# Altium schematic sheet TB_Driver.SchDoc
size A3; SheetNumber: 2; SheetTotal: 3
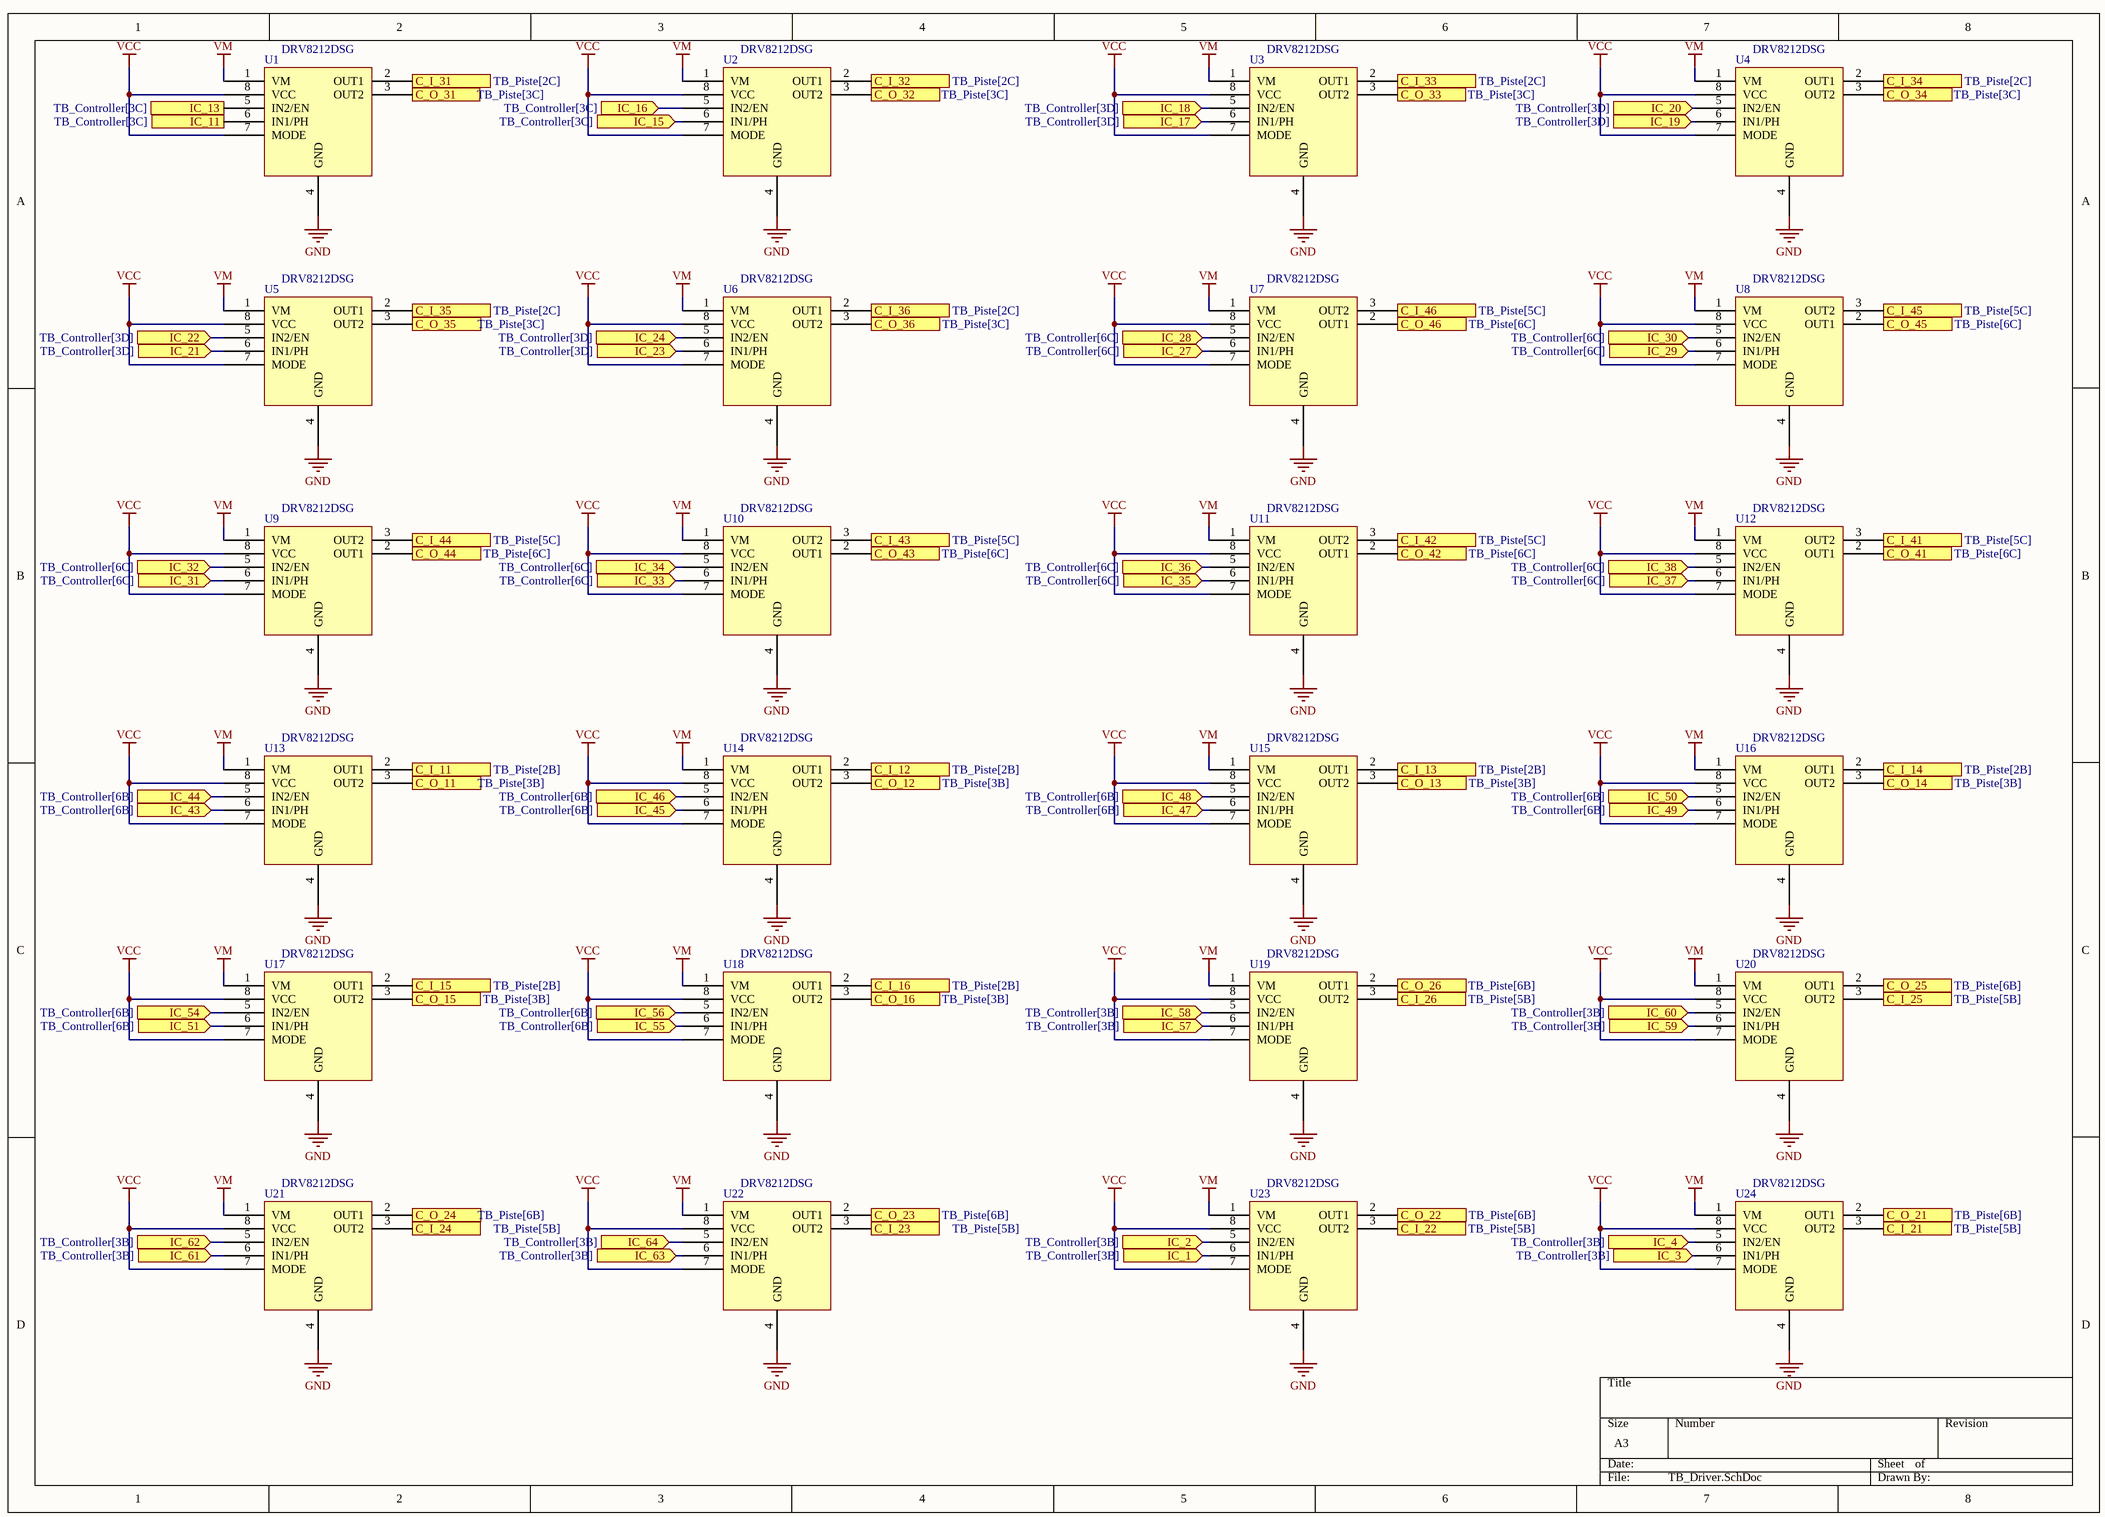
[diagram p0: TB_Driver.SchDoc]

## Parts
U1  DRV8212DSG  [DRV8212DSGR]
U2  DRV8212DSG  [DRV8212DSGR]
U3  DRV8212DSG  [DRV8212DSGR]
U4  DRV8212DSG  [DRV8212DSGR]
U5  DRV8212DSG  [DRV8212DSGR]
U6  DRV8212DSG  [DRV8212DSGR]
U7  DRV8212DSG  [DRV8212DSGR]
U8  DRV8212DSG  [DRV8212DSGR]
U9  DRV8212DSG  [DRV8212DSGR]
U10  DRV8212DSG  [DRV8212DSGR]
U11  DRV8212DSG  [DRV8212DSGR]
U12  DRV8212DSG  [DRV8212DSGR]
U13  DRV8212DSG  [DRV8212DSGR]
U14  DRV8212DSG  [DRV8212DSGR]
U15  DRV8212DSG  [DRV8212DSGR]
U16  DRV8212DSG  [DRV8212DSGR]
U17  DRV8212DSG  [DRV8212DSGR]
U18  DRV8212DSG  [DRV8212DSGR]
U19  DRV8212DSG  [DRV8212DSGR]
U20  DRV8212DSG  [DRV8212DSGR]
U21  DRV8212DSG  [DRV8212DSGR]
U22  DRV8212DSG  [DRV8212DSGR]
U23  DRV8212DSG  [DRV8212DSGR]
U24  DRV8212DSG  [DRV8212DSGR]

## Ports
C_I_11 (see TB_Piste[2B]), C_I_12 (see TB_Piste[2B]), C_I_13 (see TB_Piste[2B]), C_I_14 (see TB_Piste[2B]), C_I_15 (see TB_Piste[2B]), C_I_16 (see TB_Piste[2B]), C_I_21 (see TB_Piste[5B]), C_I_22 (see TB_Piste[5B]), C_I_23 (see TB_Piste[5B]), C_I_24 (see TB_Piste[5B]), C_I_25 (see TB_Piste[5B]), C_I_26 (see TB_Piste[5B]), C_I_31 (see TB_Piste[2C]), C_I_32 (see TB_Piste[2C]), C_I_33 (see TB_Piste[2C]), C_I_34 (see TB_Piste[2C]), C_I_35 (see TB_Piste[2C]), C_I_36 (see TB_Piste[2C]), C_I_41 (see TB_Piste[5C]), C_I_42 (see TB_Piste[5C]), C_I_43 (see TB_Piste[5C]), C_I_44 (see TB_Piste[5C]), C_I_45 (see TB_Piste[5C]), C_I_46 (see TB_Piste[5C]), C_O_11 (see TB_Piste[3B]), C_O_12 (see TB_Piste[3B]), C_O_13 (see TB_Piste[3B]), C_O_14 (see TB_Piste[3B]), C_O_15 (see TB_Piste[3B]), C_O_16 (see TB_Piste[3B]), C_O_21 (see TB_Piste[6B]), C_O_22 (see TB_Piste[6B]), C_O_23 (see TB_Piste[6B]), C_O_24 (see TB_Piste[6B]), C_O_25 (see TB_Piste[6B]), C_O_26 (see TB_Piste[6B]), C_O_31 (see TB_Piste[3C]), C_O_32 (see TB_Piste[3C]), C_O_33 (see TB_Piste[3C]), C_O_34 (see TB_Piste[3C]), C_O_35 (see TB_Piste[3C]), C_O_36 (see TB_Piste[3C]), C_O_41 (see TB_Piste[6C]), C_O_42 (see TB_Piste[6C]), C_O_43 (see TB_Piste[6C]), C_O_44 (see TB_Piste[6C]), C_O_45 (see TB_Piste[6C]), C_O_46 (see TB_Piste[6C]), IC_1 (in, see TB_Controller[3B]), IC_2 (in, see TB_Controller[3B]), IC_3 (in, see TB_Controller[3B]), IC_4 (in, see TB_Controller[3B]), IC_11 (in, see TB_Controller[3C]), IC_13 (in, see TB_Controller[3C]), IC_15 (in, see TB_Controller[3C]), IC_16 (in, see TB_Controller[3C]), IC_17 (in, see TB_Controller[3D]), IC_18 (in, see TB_Controller[3D]), IC_19 (in, see TB_Controller[3D]), IC_20 (in, see TB_Controller[3D]), IC_21 (in, see TB_Controller[3D]), IC_22 (in, see TB_Controller[3D]), IC_23 (in, see TB_Controller[3D]), IC_24 (in, see TB_Controller[3D]), IC_27 (in, see TB_Controller[6C]), IC_28 (in, see TB_Controller[6C]), IC_29 (in, see TB_Controller[6C]), IC_30 (in, see TB_Controller[6C]), IC_31 (in, see TB_Controller[6C]), IC_32 (in, see TB_Controller[6C]), IC_33 (in, see TB_Controller[6C]), IC_34 (in, see TB_Controller[6C]), IC_35 (in, see TB_Controller[6C]), IC_36 (in, see TB_Controller[6C]), IC_37 (in, see TB_Controller[6C]), IC_38 (in, see TB_Controller[6C]), IC_43 (in, see TB_Controller[6B]), IC_44 (in, see TB_Controller[6B]), IC_45 (in, see TB_Controller[6B]), IC_46 (in, see TB_Controller[6B]), IC_47 (in, see TB_Controller[6B]), IC_48 (in, see TB_Controller[6B]), IC_49 (in, see TB_Controller[6B]), IC_50 (in, see TB_Controller[6B]), IC_51 (in, see TB_Controller[6B]), IC_54 (in, see TB_Controller[6B]), IC_55 (in, see TB_Controller[6B]), IC_56 (in, see TB_Controller[6B]), IC_57 (in, see TB_Controller[3B]), IC_58 (in, see TB_Controller[3B]), IC_59 (in, see TB_Controller[3B]), IC_60 (in, see TB_Controller[3B]), IC_61 (in, see TB_Controller[3B]), IC_62 (in, see TB_Controller[3B]), IC_63 (in, see TB_Controller[3B]), IC_64 (in, see TB_Controller[3B])

## Nets
GND: U1.4(GND) U2.4(GND) U3.4(GND) U4.4(GND) U5.4(GND) U6.4(GND) U7.4(GND) U8.4(GND) U9.4(GND) U10.4(GND) U11.4(GND) U12.4(GND) U13.4(GND) U14.4(GND) U15.4(GND) U16.4(GND) U17.4(GND) U18.4(GND) U19.4(GND) U20.4(GND) U21.4(GND) U22.4(GND) U23.4(GND) U24.4(GND)
VCC: U1.7(MODE) U1.8(VCC) U2.7(MODE) U2.8(VCC) U3.7(MODE) U3.8(VCC) U4.7(MODE) U4.8(VCC) U5.7(MODE) U5.8(VCC) U6.7(MODE) U6.8(VCC) U7.7(MODE) U7.8(VCC) U8.7(MODE) U8.8(VCC) U9.7(MODE) U9.8(VCC) U10.7(MODE) U10.8(VCC) U11.7(MODE) U11.8(VCC) U12.7(MODE) U12.8(VCC) U13.7(MODE) U13.8(VCC) U14.7(MODE) U14.8(VCC) U15.7(MODE) U15.8(VCC) U16.7(MODE) U16.8(VCC) U17.7(MODE) U17.8(VCC) U18.7(MODE) U18.8(VCC) U19.7(MODE) U19.8(VCC) U20.7(MODE) U20.8(VCC) U21.7(MODE) U21.8(VCC) U22.7(MODE) U22.8(VCC) U23.7(MODE) U23.8(VCC) U24.7(MODE) U24.8(VCC)
VM: U1.1(VM) U2.1(VM) U3.1(VM) U4.1(VM) U5.1(VM) U6.1(VM) U7.1(VM) U8.1(VM) U9.1(VM) U10.1(VM) U11.1(VM) U12.1(VM) U13.1(VM) U14.1(VM) U15.1(VM) U16.1(VM) U17.1(VM) U18.1(VM) U19.1(VM) U20.1(VM) U21.1(VM) U22.1(VM) U23.1(VM) U24.1(VM)
C_I_11: U13.2(OUT1) ; port C_I_11
C_I_12: U14.2(OUT1) ; port C_I_12
C_I_13: U15.2(OUT1) ; port C_I_13
C_I_14: U16.2(OUT1) ; port C_I_14
C_I_15: U17.2(OUT1) ; port C_I_15
C_I_16: U18.2(OUT1) ; port C_I_16
C_I_21: U24.3(OUT2) ; port C_I_21
C_I_22: U23.3(OUT2) ; port C_I_22
C_I_23: U22.3(OUT2) ; port C_I_23
C_I_24: U21.3(OUT2) ; port C_I_24
C_I_25: U20.3(OUT2) ; port C_I_25
C_I_26: U19.3(OUT2) ; port C_I_26
C_I_31: U1.2(OUT1) ; port C_I_31
C_I_32: U2.2(OUT1) ; port C_I_32
C_I_33: U3.2(OUT1) ; port C_I_33
C_I_34: U4.2(OUT1) ; port C_I_34
C_I_35: U5.2(OUT1) ; port C_I_35
C_I_36: U6.2(OUT1) ; port C_I_36
C_I_41: U12.3(OUT2) ; port C_I_41
C_I_42: U11.3(OUT2) ; port C_I_42
C_I_43: U10.3(OUT2) ; port C_I_43
C_I_44: U9.3(OUT2) ; port C_I_44
C_I_45: U8.3(OUT2) ; port C_I_45
C_I_46: U7.3(OUT2) ; port C_I_46
C_O_11: U13.3(OUT2) ; port C_O_11
C_O_12: U14.3(OUT2) ; port C_O_12
C_O_13: U15.3(OUT2) ; port C_O_13
C_O_14: U16.3(OUT2) ; port C_O_14
C_O_15: U17.3(OUT2) ; port C_O_15
C_O_16: U18.3(OUT2) ; port C_O_16
C_O_21: U24.2(OUT1) ; port C_O_21
C_O_22: U23.2(OUT1) ; port C_O_22
C_O_23: U22.2(OUT1) ; port C_O_23
C_O_24: U21.2(OUT1) ; port C_O_24
C_O_25: U20.2(OUT1) ; port C_O_25
C_O_26: U19.2(OUT1) ; port C_O_26
C_O_31: U1.3(OUT2) ; port C_O_31
C_O_32: U2.3(OUT2) ; port C_O_32
C_O_33: U3.3(OUT2) ; port C_O_33
C_O_34: U4.3(OUT2) ; port C_O_34
C_O_35: U5.3(OUT2) ; port C_O_35
C_O_36: U6.3(OUT2) ; port C_O_36
C_O_41: U12.2(OUT1) ; port C_O_41
C_O_42: U11.2(OUT1) ; port C_O_42
C_O_43: U10.2(OUT1) ; port C_O_43
C_O_44: U9.2(OUT1) ; port C_O_44
C_O_45: U8.2(OUT1) ; port C_O_45
C_O_46: U7.2(OUT1) ; port C_O_46
IC_1: U23.6(IN1/PH) ; port IC_1
IC_2: U23.5(IN2/EN) ; port IC_2
IC_3: U24.6(IN1/PH) ; port IC_3
IC_4: U24.5(IN2/EN) ; port IC_4
IC_11: U1.6(IN1/PH) ; port IC_11
IC_13: U1.5(IN2/EN) ; port IC_13
IC_15: U2.6(IN1/PH) ; port IC_15
IC_16: U2.5(IN2/EN) ; port IC_16
IC_17: U3.6(IN1/PH) ; port IC_17
IC_18: U3.5(IN2/EN) ; port IC_18
IC_19: U4.6(IN1/PH) ; port IC_19
IC_20: U4.5(IN2/EN) ; port IC_20
IC_21: U5.6(IN1/PH) ; port IC_21
IC_22: U5.5(IN2/EN) ; port IC_22
IC_23: U6.6(IN1/PH) ; port IC_23
IC_24: U6.5(IN2/EN) ; port IC_24
IC_27: U7.6(IN1/PH) ; port IC_27
IC_28: U7.5(IN2/EN) ; port IC_28
IC_29: U8.6(IN1/PH) ; port IC_29
IC_30: U8.5(IN2/EN) ; port IC_30
IC_31: U9.6(IN1/PH) ; port IC_31
IC_32: U9.5(IN2/EN) ; port IC_32
IC_33: U10.6(IN1/PH) ; port IC_33
IC_34: U10.5(IN2/EN) ; port IC_34
IC_35: U11.6(IN1/PH) ; port IC_35
IC_36: U11.5(IN2/EN) ; port IC_36
IC_37: U12.6(IN1/PH) ; port IC_37
IC_38: U12.5(IN2/EN) ; port IC_38
IC_43: U13.6(IN1/PH) ; port IC_43
IC_44: U13.5(IN2/EN) ; port IC_44
IC_45: U14.6(IN1/PH) ; port IC_45
IC_46: U14.5(IN2/EN) ; port IC_46
IC_47: U15.6(IN1/PH) ; port IC_47
IC_48: U15.5(IN2/EN) ; port IC_48
IC_49: U16.6(IN1/PH) ; port IC_49
IC_50: U16.5(IN2/EN) ; port IC_50
IC_51: U17.6(IN1/PH) ; port IC_51
IC_54: U17.5(IN2/EN) ; port IC_54
IC_55: U18.6(IN1/PH) ; port IC_55
IC_56: U18.5(IN2/EN) ; port IC_56
IC_57: U19.6(IN1/PH) ; port IC_57
IC_58: U19.5(IN2/EN) ; port IC_58
IC_59: U20.6(IN1/PH) ; port IC_59
IC_60: U20.5(IN2/EN) ; port IC_60
IC_61: U21.6(IN1/PH) ; port IC_61
IC_62: U21.5(IN2/EN) ; port IC_62
IC_63: U22.6(IN1/PH) ; port IC_63
IC_64: U22.5(IN2/EN) ; port IC_64